# Altium schematic sheet WL-RF-AMP.SchDoc
size 594 x 420 mm; Address1: Address1; Address2: Address2; Address3: Address3; Address4: Address4; DocumentNumber: WOLF-RF-UNIT; SheetNumber: 6; Scale: 1:1; DocumentType: Схема электрическая принципиальная; FirstReferrence: UA3REO
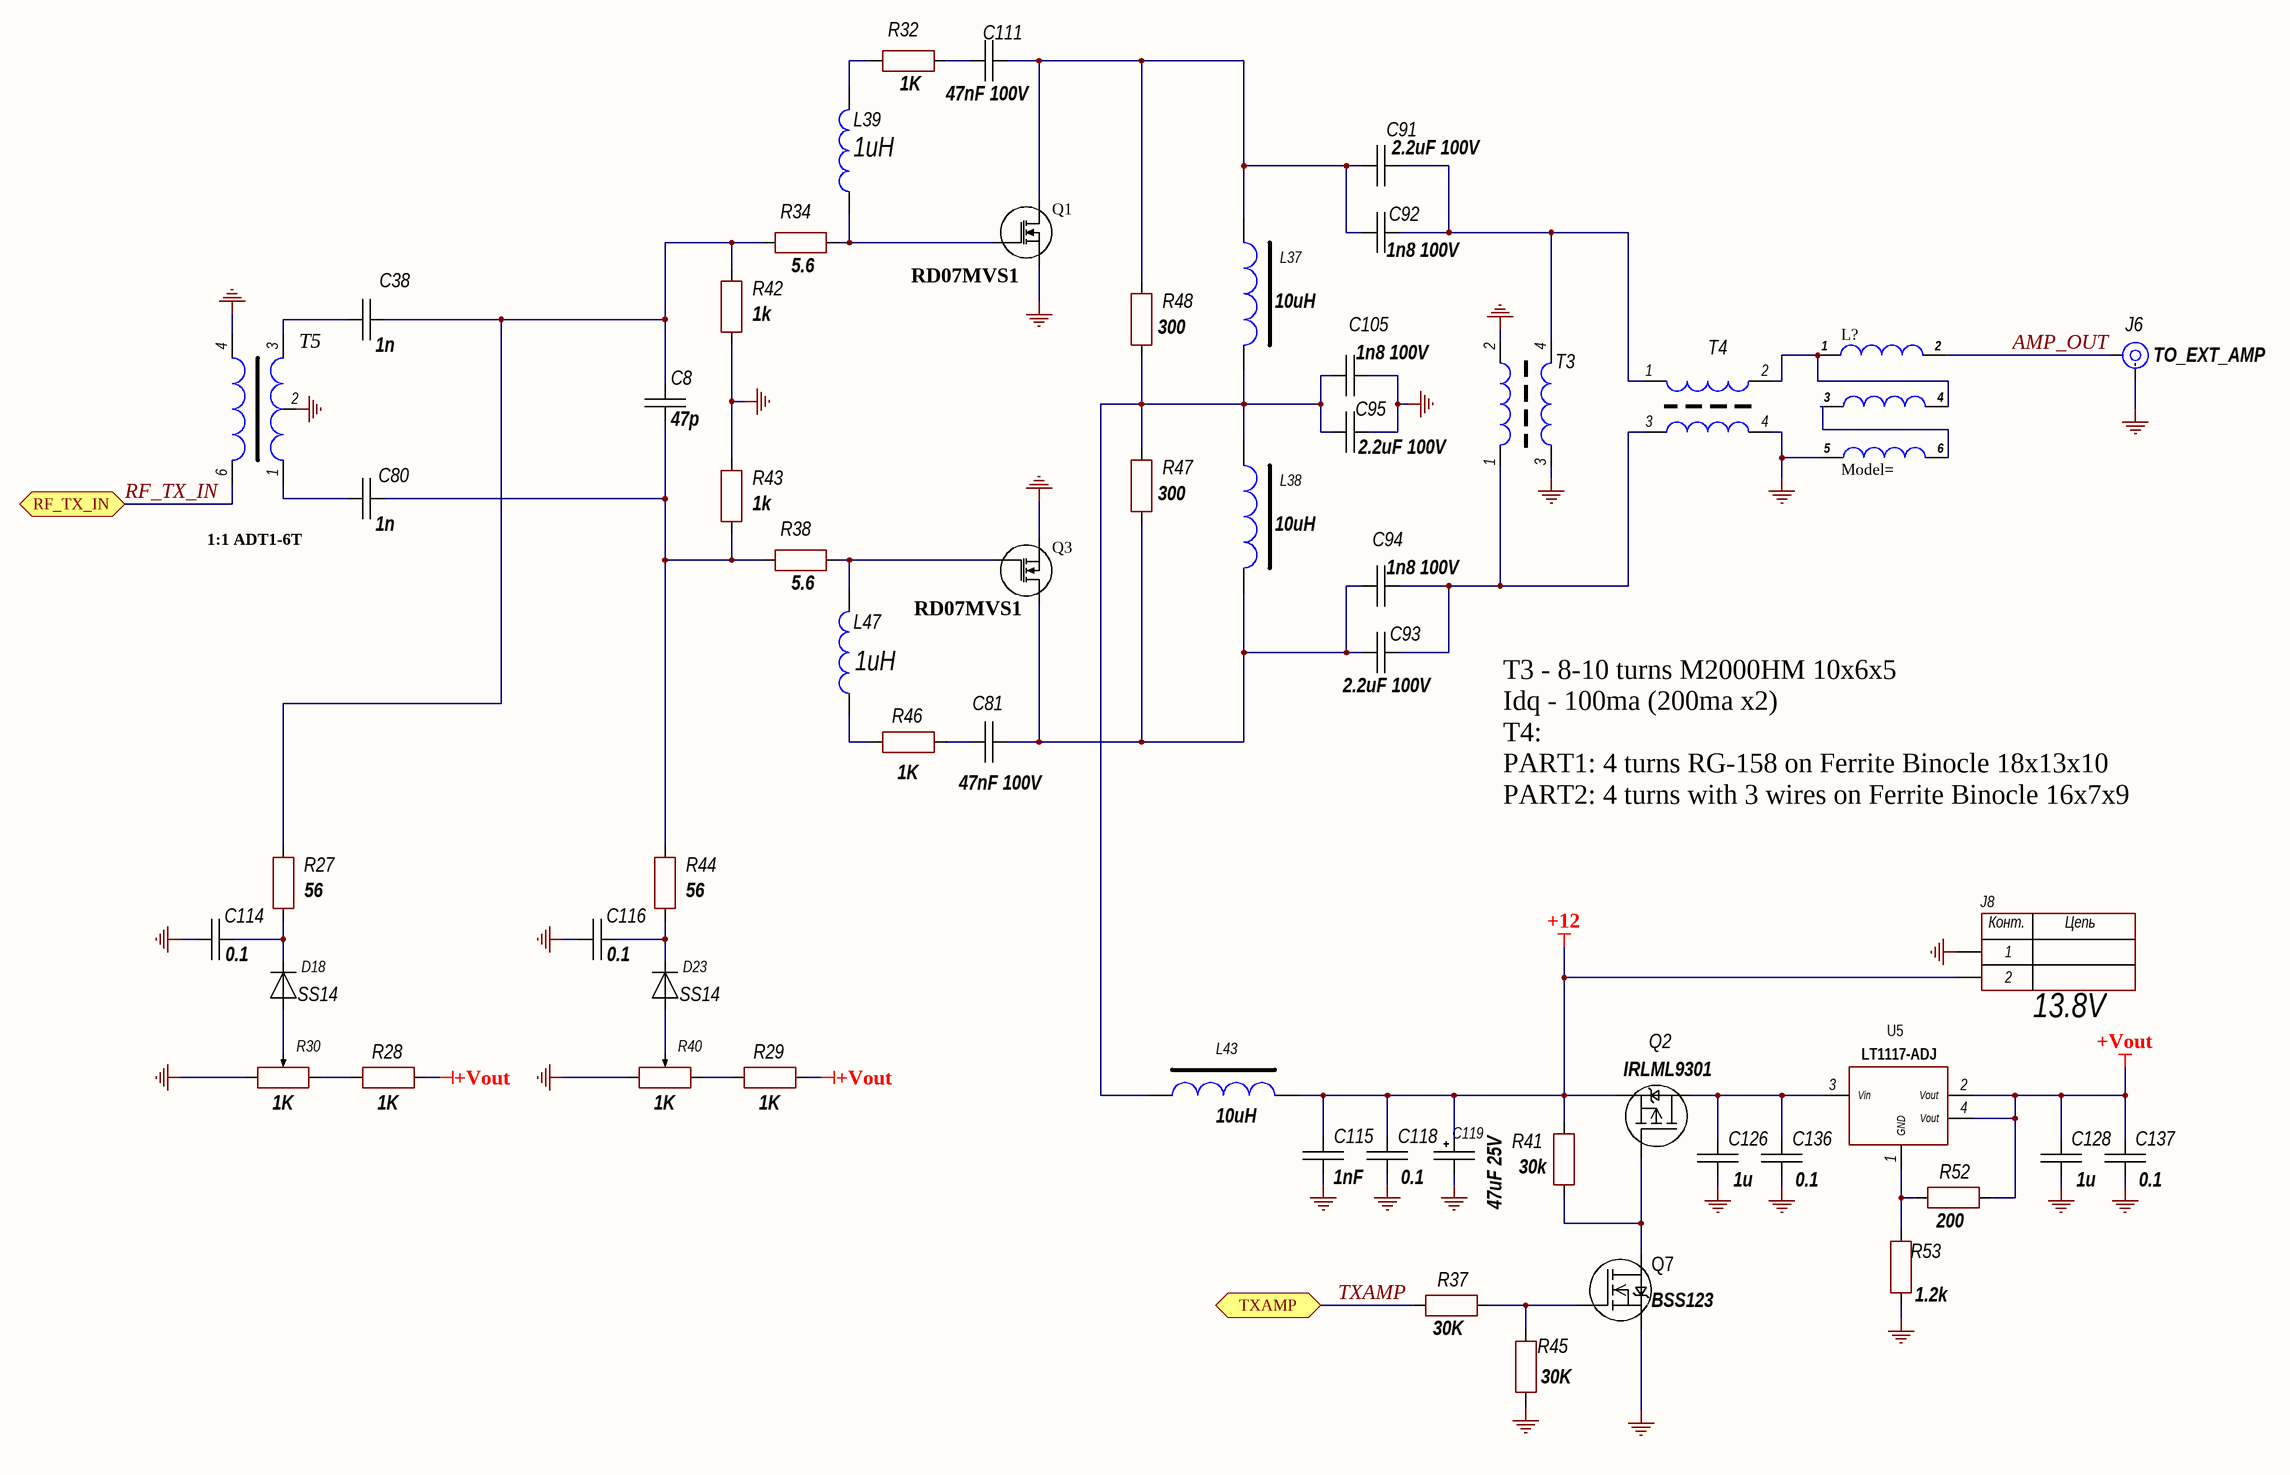
[diagram p0: WL-RF-AMP.SchDoc]

## Parts
C8  47p  [CH0805C]
C38  1n  [CH0805C]
C80  1n  [CH0805C]
C81  47nF 100V  [CH0805C]
C91  2.2uF 100V  [CH0805C]
C92  1n8 100V  [CH0805C]
C93  2.2uF 100V  [CH0805C]
C94  1n8 100V  [CH0805C]
C95  2.2uF 100V  [CH0805C]
C105  1n8 100V  [CH0805C]
C111  47nF 100V  [CH0805C]
C114  0.1  [CH0805C]
C115  1nF  [CH0805C]
C116  0.1  [CH0805C]
C118  0.1  [CH0805C]
C119  47uF 25V  [TANTAL_B]
C126  1u  [CH0805C]
C128  1u  [CH0805C]
C136  0.1  [CH0805C]
C137  0.1  [CH0805C]
D18  SS14  [SOD123]
D23  SS14  [SOD123]
J6  TO_EXT_AMP  [CON: SMA]
J8  13.8V  [CON: 300-02P-5.0]
L37  10uH
L38  10uH
L39  1uH  [IND: R24]
L43  10uH
L47  1uH  [IND: R24]
L?  Model=
Q1  RD07MVS1  [RD07]
Q2  IRLML9301  [D2PAK_132]
Q3  RD07MVS1  [RD07]
Q7  BSS123  [SOT23_132]
R27  56  [CH0805R]
R28  1K  [CH0805R]
R29  1K  [CH0805R]
R30  1K  [RES: 3296W]
R32  1K  [CH0805R]
R34  5.6  [CH0805R]
R37  30K  [CH0805R]
R38  5.6  [CH0805R]
R40  1K  [RES: 3296W]
R41  30k  [CH0805R]
R42  1k  [CH0805R]
R43  1k  [CH0805R]
R44  56  [CH0805R]
R45  30K  [CH0805R]
R46  1K  [CH0805R]
R47  300  [CH0805R]
R48  300  [CH0805R]
R52  200  [CH0805R]
R53  1.2k  [CH0805R]
T3  BN-43-302  (value not drawn)
T4  BN-43-302  (value not drawn)
T5  1:1 ADT1-6T  [TC1-4]
U5  LT1117-ADJ  [SOT223]

## Ports
RF_TX_IN (bidir), TXAMP (bidir)

## Nets
+12: C115.2 C118.2 C119.1 J8.2 L43.2 Q2.2(I) R41.1
+Vout: C128.2 C137.2 R28.2 R29.2 R52.2 U5.2(Vout) U5.4(Vout)
GND: C95.2 C105.2 C114.2 C115.1 C116.2 C118.1 C119.2 C126.1 C128.1 C136.1 C137.1 J6.1(IN) J8.1 L?.5 Q1.2(S) Q3.2(S) Q7.2(I) R30.1 R40.1 R42.2 R43.1 R45.1 R53.1 T3.2 T3.3 T4.4 T5.2 T5.4
AMP_OUT: J6.2(IN) L?.2
RF_TX_IN: T5.6 ; port RF_TX_IN
TXAMP: R37.1 ; port TXAMP
NetC8_1: C8.1 C80.2 R38.1 R43.2 R44.1
NetC8_2: C8.2 C38.2 R27.1 R34.1 R42.1
NetC38_1: C38.1 T5.3
NetC80_1: C80.1 T5.1
NetC81_1: C81.1 R46.2
NetC81_2: C81.2 C93.1 C94.1 L38.2 Q3.1(D) R47.2
NetC91_1: C91.1 C92.1 C111.2 L37.1 Q1.1(D) R48.1
NetC91_2: C91.2 C92.2 T3.4 T4.1
NetC93_2: C93.2 C94.2 T3.1 T4.3
NetC95_1: C95.1 C105.1 L37.2 L38.1 L43.1 R47.1 R48.2
NetC111_1: C111.1 R32.2
NetC114_1: C114.1 D18.2 R27.2
NetC116_1: C116.1 D23.2 R44.2
NetC126_2: C126.2 C136.2 Q2.3(Сток(Drain)) U5.3(Vin)
NetD18_1: D18.1 R30.2
NetD23_1: D23.1 R40.2
NetL39_1: L39.1 R32.1
NetL39_2: L39.2 Q1.3(G) R34.2
NetL47_1: L47.1 R46.1
NetL47_2: L47.2 Q3.3(G) R38.2
NetL?_1: L?.1 L?.4 T4.2
NetL?_3: L?.3 L?.6
NetQ2_1: Q2.1(Затвор(Gate)) Q7.3(Сток(Drain)) R41.2
NetQ7_1: Q7.1(Затвор(Gate)) R37.2 R45.2
NetR28_1: R28.1 R30.3
NetR29_1: R29.1 R40.3
NetR52_1: R52.1 R53.2 U5.1(GND)

## Notes on the sheet
- T3 - 8-10 turns М2000НМ 10х6х5
  Idq - 100ma (200ma x2)
  T4:
  PART1: 4 turns RG-158 on Ferrite Binocle 18х13x10
  PART2: 4 turns with 3 wires on Ferrite Binocle 16x7x9
- Перв. примен.
- Справ. №
- Подп. и дата
- Инв. № дубл.
- Взам. инв. №
- Инв. № подл.
- Изм.
- Лист
- № докум.
- Подп.
- Дата
- 2.106-A2
- Копировал
- Формат А2
- (in symbol 2-Connector) Конт.; Цепь

## Library data of the parts
C8 C38 C80 C81 C91-C95 C105 C111 C114-C116 C118 C126 C128 C136 C137 = Capacitor: Manufacturer: *; Model: *; HelpURL: *; ComponentKind: *; Value: *
C119 = TantalCap: Manufacturer: *; Model: *; HelpURL: *; ComponentKind: *; Value: *
D18 D23 = Diod: ComponentKind: *; Manufacturer: *; Model: *; HelpURL: *
J6 = SMA: RF; Model: *; Manufacturer: *; HelpURL: *; ComponentKind: *
J8 = 2-Connector: Model: *; Manufacturer: *; HelpURL: *; ComponentKind: *
L37 L38 L43 = TRANS
L39 L47 = Inductor ring: Value: {Value}; Model: *; ComponentKind: *; Manufacturer: *; HelpURL: *
L? = Inductor-3
Q1 Q3 = N
Q2 = P-KANAL
Q7 = N-KANAL
R27-R29 R32 R34 R37 R38 R41-R48 R52 R53 = Resistor: Manufacturer: *; Model: *; HelpURL: *; ComponentKind: *; Value: *
R30 R40 = ADJ resistor: Manufacturer: *; Model: *; HelpURL: *; ComponentKind: *; Value: *
T5 = TC4-1
U5 = AMS117